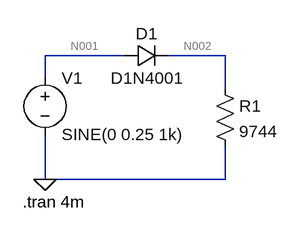
[diagram p0: schematic half-wave.asc]
half-wave.asc, the LTspice schematic file:
Version 4
SHEET 1 880 680
WIRE 128 144 16 144
WIRE 272 144 192 144
WIRE 16 176 16 144
WIRE 272 192 272 144
WIRE 16 320 16 256
WIRE 272 320 272 272
WIRE 272 320 16 320
FLAG 16 320 0
SYMBOL res 256 176 R0
SYMATTR InstName R1
SYMATTR Value 9744
SYMBOL diode 128 160 R270
WINDOW 0 32 32 VTop 2
WINDOW 3 0 32 VBottom 2
SYMATTR InstName D1
SYMATTR Value D1N4001
SYMBOL voltage 16 160 R0
WINDOW 123 0 0 Left 0
WINDOW 39 0 0 Left 0
SYMATTR InstName V1
SYMATTR Value SINE(0 0.25 1k)
TEXT -16 352 Left 2 !.tran 4m

The netlist it stands for:
* half-wave.asc
R1 N002 0 9744
D1 N001 N002 D1N4001
V1 N001 0 SINE(0 0.25 1k)
.model D D
.lib standard.dio
.tran 4m
.backanno
.end

* Results of the author's LTspice run, read from the files saved beside the schematic
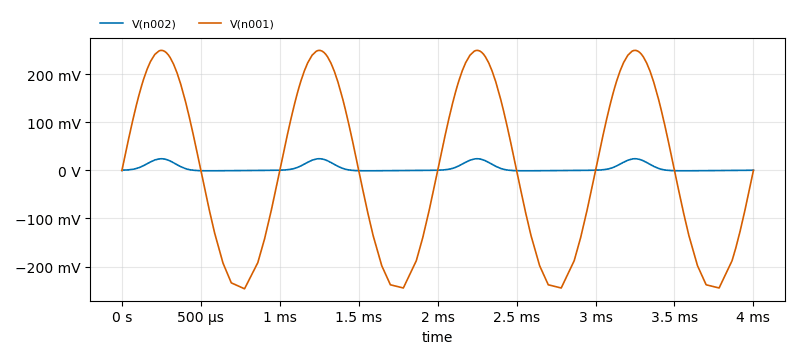
[diagram p1: Transient Analysis of half-wave.asc, plotted from the saved traces]
* Transient Analysis, 1 run:
*   V(n002): min -703 µV, max 24.33 mV, average 4.896 mV, rms 9.411 mV, last 523.3 µV
*   V(n001): min -246.4 mV, max 250 mV, average 1.075 mV, rms 175.8 mV, last 0 V